# EAGLE design Drone (EAGLE 9.6.2)
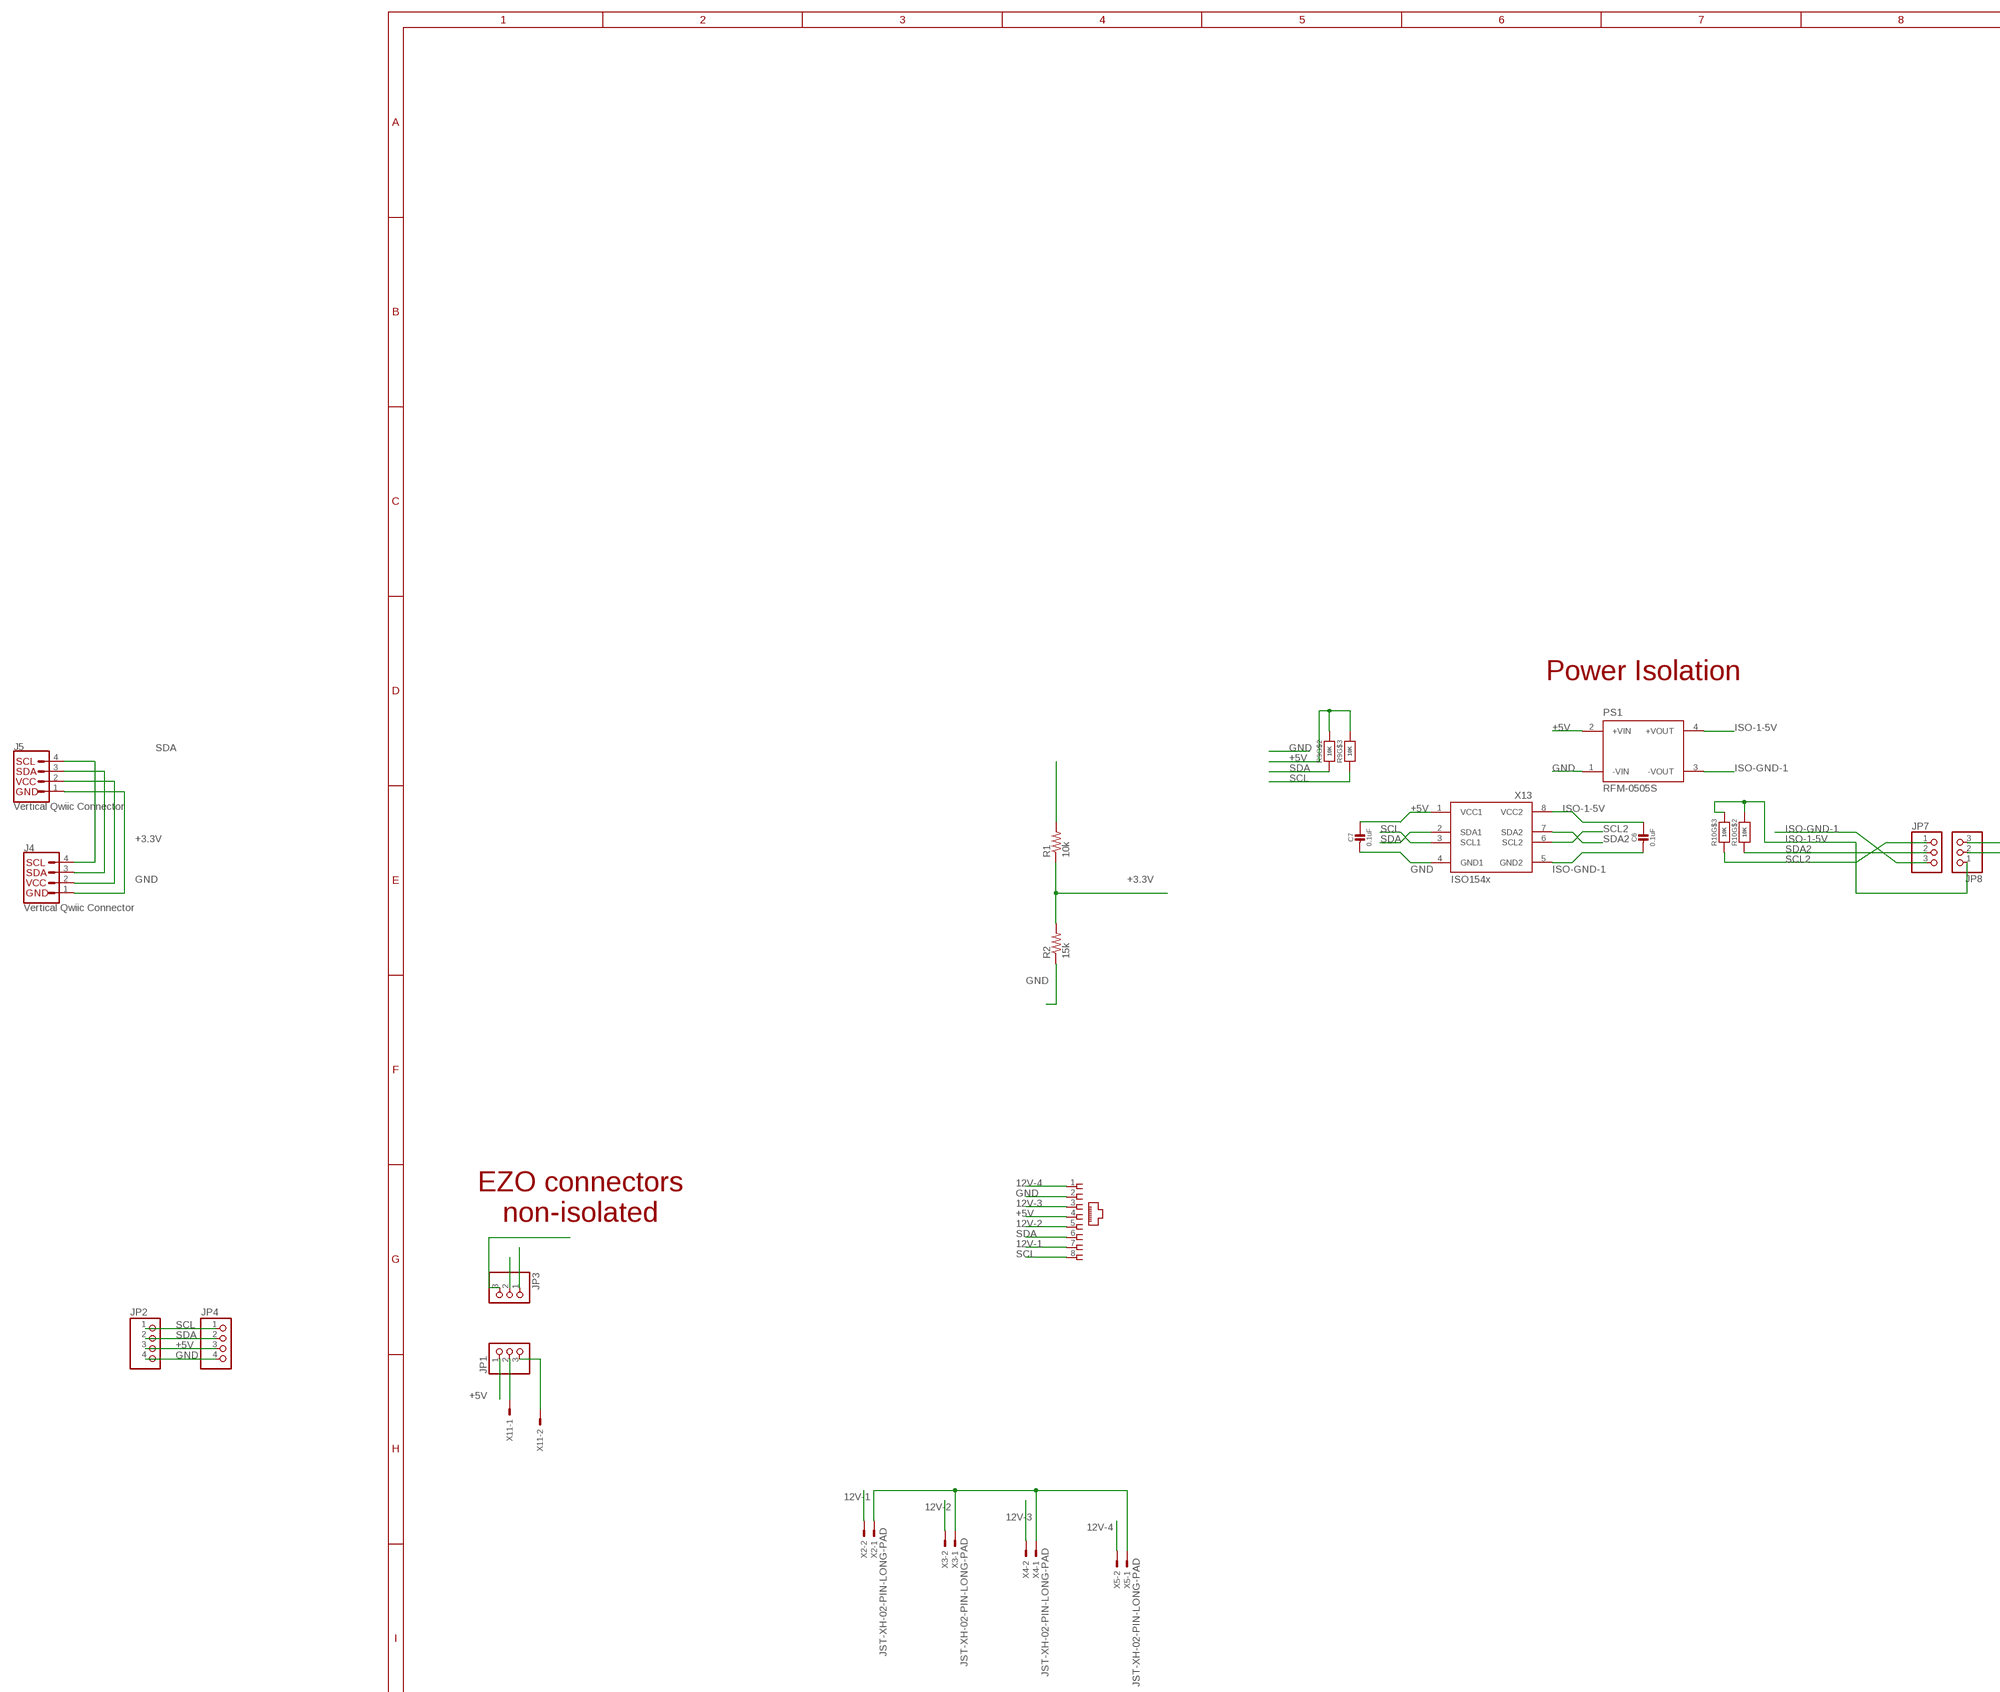
[diagram p0: schematic, sheet 1, part 1 of 2]
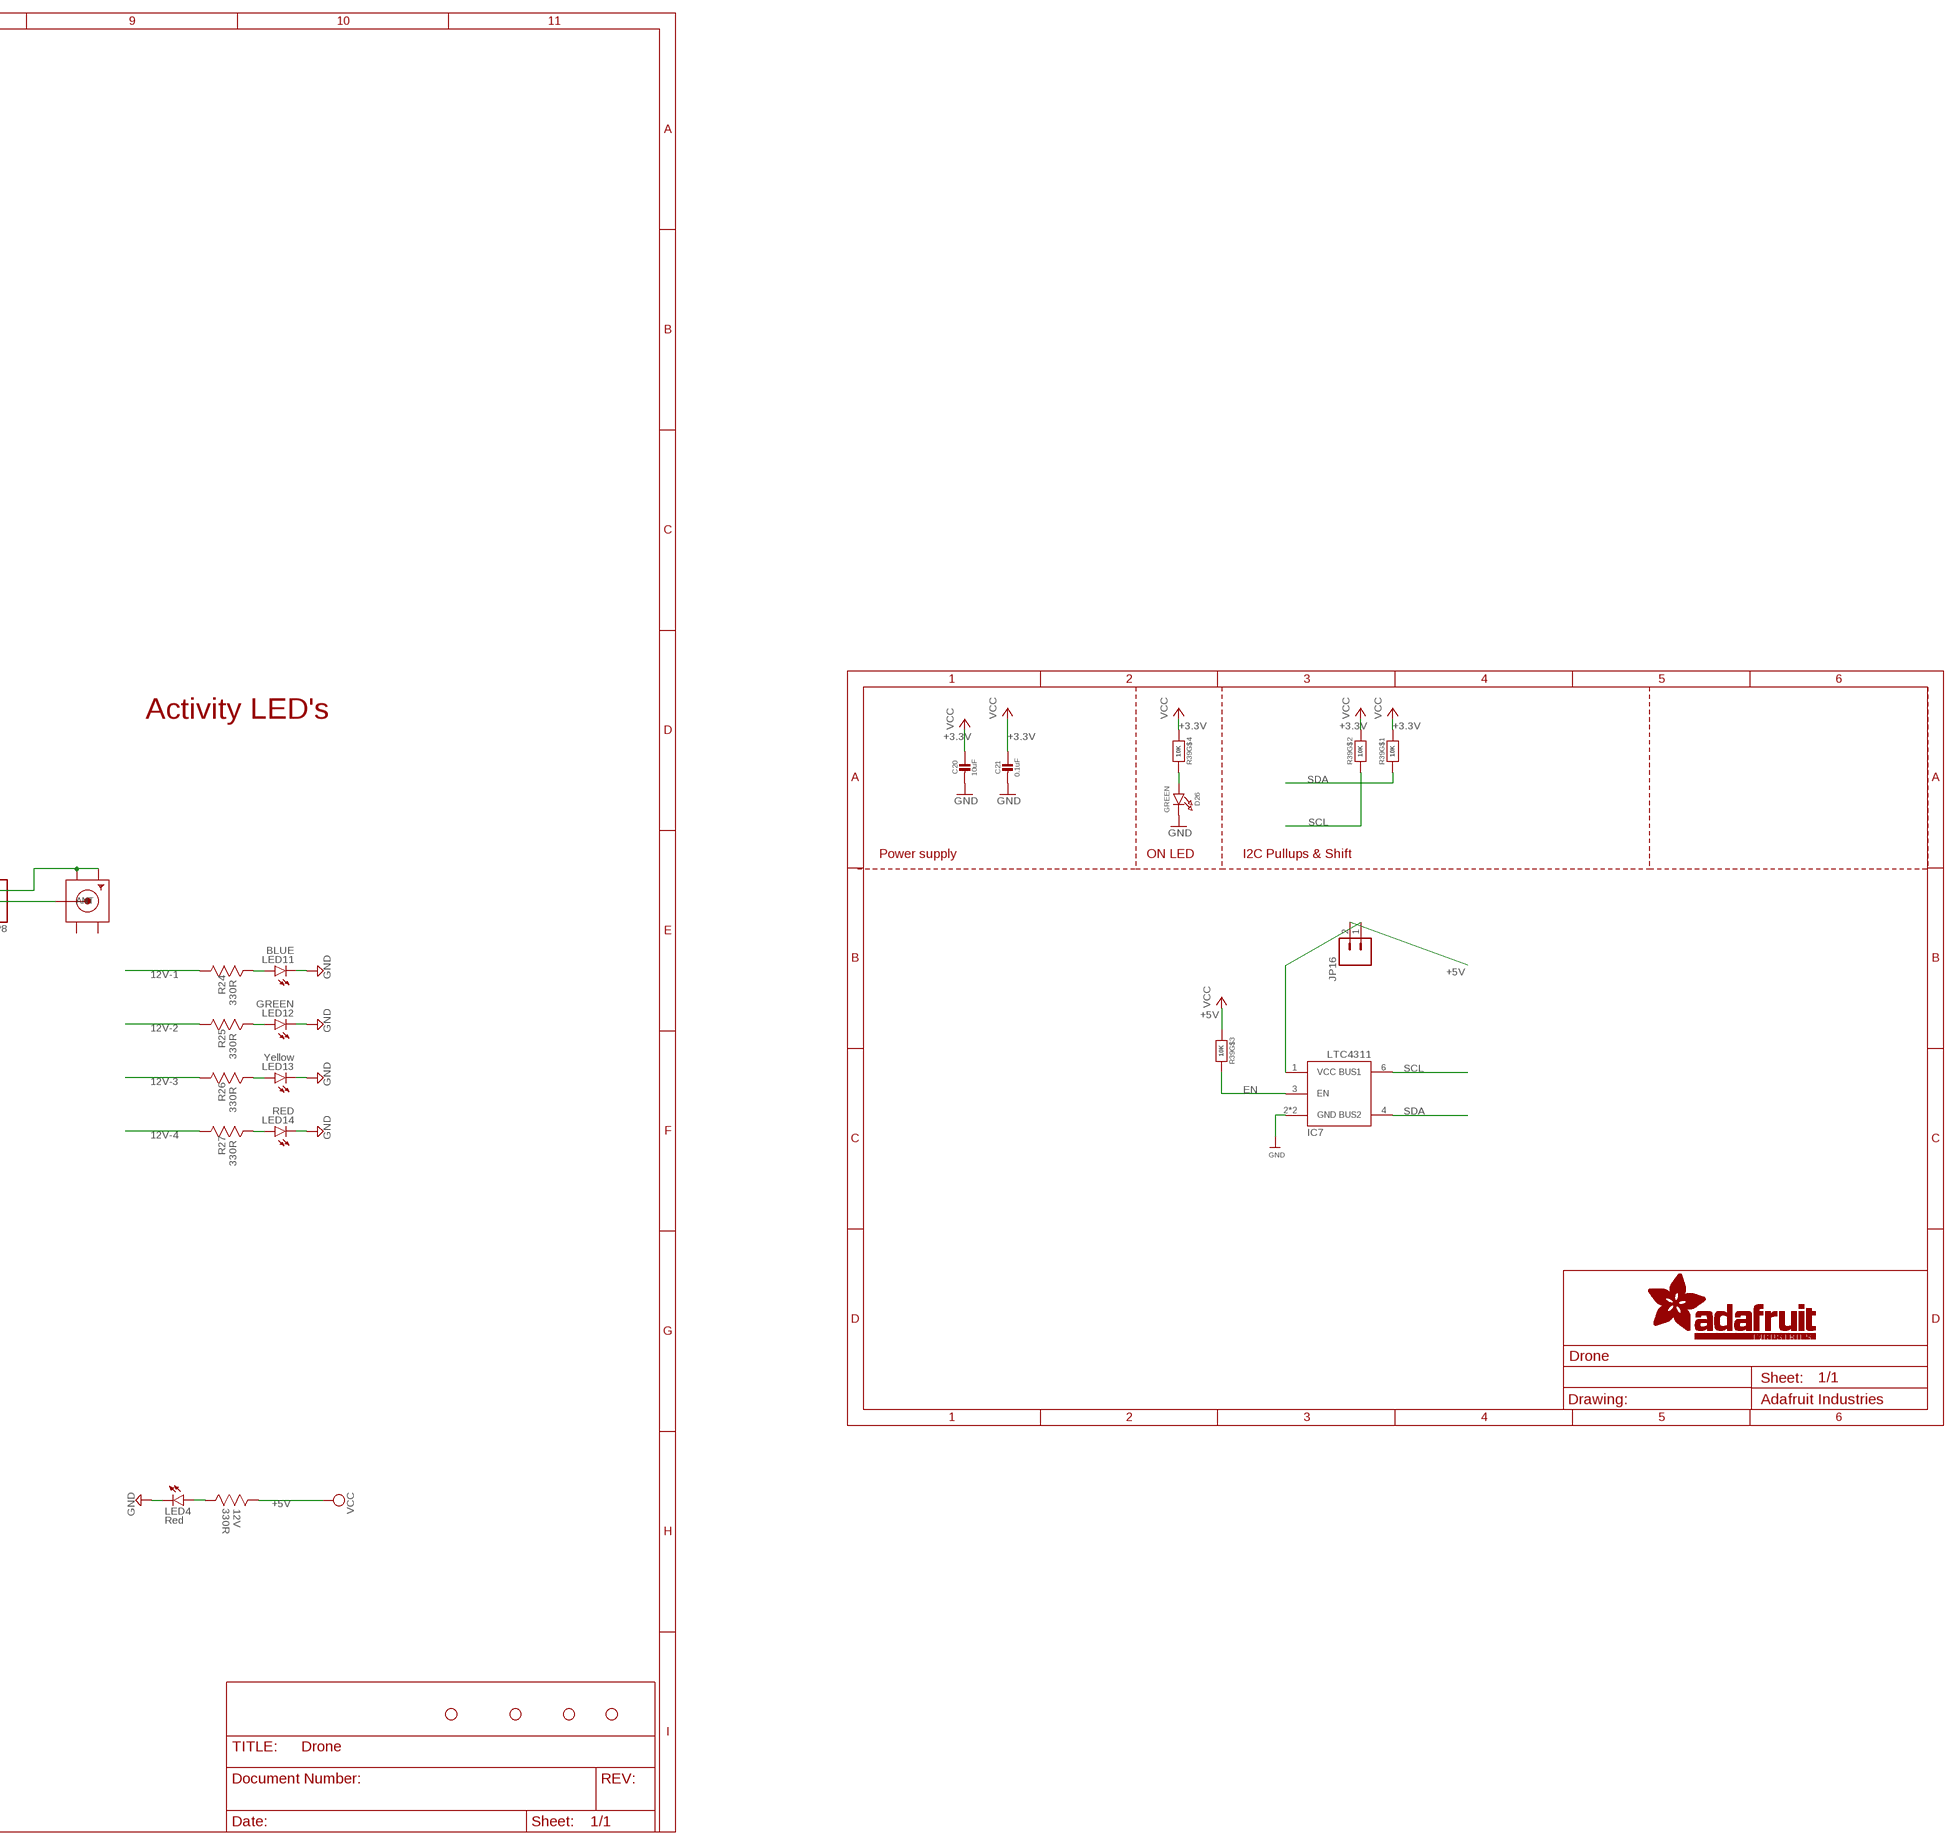
[diagram p1: schematic, sheet 1, part 2 of 2]

## Parts
12V  330R  MC0.063W06031%330R  [RESC1608X60N]
C6  0.1uF  CAP_CERAMIC0603_NO  [0603-NO]
C7  0.1uF  CAP_CERAMIC0603_NO  [0603-NO]
C20  10uF  CAP_CERAMIC0805-NOOUTLINE  [0805-NO]
C21  0.1uF  CAP_CERAMIC0603_NO  [0603-NO]
D26  GREEN  LED0603_NOOUTLINE  [CHIPLED_0603_NOOUTLINE]
H5  STAND-OFF  [STAND-OFF]
H6  STAND-OFF  [STAND-OFF]
H7  STAND-OFF  [STAND-OFF]
H8  STAND-OFF  [STAND-OFF]
IC7  LTC4311_SC70  [SC70-6L]
J4  Vertical Qwiic Connector  QWIIC_CONNECTOR  [JST04_1MM_VERT]
J5  Vertical Qwiic Connector  QWIIC_CONNECTOR  [JST04_1MM_VERT]
JP1  PINHD-1X3CB  [1X03-CLEANBIG]
JP2  PINHD-1X4  [1X04]
JP3  PINHD-1X3CB  [1X03-CLEANBIG]
JP4  PINHD-1X4  [1X04]
JP7  PINHD-1X3CB  [1X03-CLEANBIG]
JP8  PINHD-1X3CB  [1X03-CLEANBIG]
JP16  CONN_02  [1X02]
LED4  Red  LED-RED-0603-WE  [LED-0603]
LED11  BLUE  LED-BLUE0603  [LED-0603]
LED12  GREEN  LED-GREEN0603  [LED-0603]
LED13  Yellow  LED-YELLOW0603  [LED-0603]
LED14  RED  LED-RED0603  [LED-0603]
PS1  RFM-0505S  [CONV_RFM-0505S]
PUMPBOX-2  RJ45-6L-B  [RJ45-NO-SHIELD]
R1  10k  R-US_R0805  [R0805]
R2  15k  R-US_R0805  [R0805]
R9  10K  RESISTOR_4PACK  [RESPACK_4X0603]
R10  10K  RESISTOR_4PACK  [RESPACK_4X0603]
R24  330R  MC0.063W06031%330R  [RESC1608X60N]
R25  330R  MC0.063W06031%330R  [RESC1608X60N]
R26  330R  MC0.063W06031%330R  [RESC1608X60N]
R27  330R  MC0.063W06031%330R  [RESC1608X60N]
R39  10K  RESISTOR_4PACK  [RESPACK_4X0603]
X1  SMACONNECTOR_EDGE  [SMA_EDGELAUNCH]
X2  JST-XH-02-PIN-LONG-PAD  [JST-XH-02-PACKAGE-LONG-PAD]
X3  JST-XH-02-PIN-LONG-PAD  [JST-XH-02-PACKAGE-LONG-PAD]
X4  JST-XH-02-PIN-LONG-PAD  [JST-XH-02-PACKAGE-LONG-PAD]
X5  JST-XH-02-PIN-LONG-PAD  [JST-XH-02-PACKAGE-LONG-PAD]
X11  jst-xh-2  JST-XH-02-PIN-LONG-PAD  [JST-XH-02-PACKAGE-LONG-PAD]
X13  ISO154X  [SOIC8_150MIL]

## Nets
12V-1: PUMPBOX-2.7 R24.1(R1) X2.2
12V-2: PUMPBOX-2.5 R25.1(R1) X3.2
12V-3: PUMPBOX-2.3 R26.1(R1) X4.2
12V-4: PUMPBOX-2.1 R27.1(R1) X5.2
+3.3V [3.3v]: C20.1 C21.1 J4.2 J5.2 R1.1 R2.2 R39.4 R39.7 R39.8 ; supply symbol labelled VCC
+5V [5v]: 12V.1(R1) C7.1 JP1.1 JP2.3 JP4.3 JP16.2 PS1.2(+VIN) PUMPBOX-2.4 R1.2 R9.6 R9.7 R39.3 X13.1(VCC1) ; supply symbol labelled VCC
EN: IC7.3(EN) R39.6
GND: C7.2 C20.2 C21.2 D26.C IC7.2(GND) IC7.5(GND) J4.1 J5.1 JP2.4 JP3.3 JP4.4 LED4.C LED11.C LED12.C LED13.C LED14.C PS1.1(-VIN) PUMPBOX-2.2 R2.1 X2.1 X3.1 X4.1 X5.1 X13.4(GND1)
ISO-1-5V: C6.1 JP8.1 PS1.4(+VOUT) R10.6 R10.7 X13.8(VCC2)
ISO-GND-1: C6.2 JP7.3 PS1.3(-VOUT) X13.5(GND2)
N$1: JP1.2 X11.1
N$2: JP3.2
N$3: JP1.3 X11.2
N$14: JP8.3 X1.GND@3(GND2) X1.GND@4(GND1)
N$16: JP8.2 X1.P(ANT)
N$39: IC7.1(VCC) JP16.1
N$41: D26.A R39.5
N$47: 12V.2(R2) LED4.A
N$54 [GPIO]: LED11.A R24.2(R2)
N$55 [GPIO]: LED12.A R25.2(R2)
N$56 [GPIO]: LED13.A R26.2(R2)
N$57 [GPIO]: LED14.A R27.2(R2)
SCL: IC7.6(BUS1) J4.4 J5.4 JP2.1 JP3.1 JP4.1 PUMPBOX-2.8 R9.3 R39.2 X13.3(SCL1)
SCL2: JP7.1 R10.3 X13.6(SCL2)
SDA: IC7.4(BUS2) J4.3 J5.3 JP2.2 JP4.2 PUMPBOX-2.6 R9.2 R39.1 X13.2(SDA1)
SDA2: JP7.2 R10.2 X13.7(SDA2)
Unconnected: R9.1 R9.4 R9.5 R9.8 R10.1 R10.4 R10.5 R10.8

## Notes on the sheet
- Power Isolation | Activity LED's
- Power supply | ON LED | I2C Pullups & Shift
- EZO connectors
  non-isolated

## Power pins joined to a net without a drawn wire
GND3: X1.GND@2(GND3)
GND4: X1.GND@1(GND4)

## Library data of the parts
12V R24-R27 = Multicomp:MC0.063W06031%330R: RESISTOR, 0603; MPN: MC0.063W06031%330R; OC_FARNELL: 9331018; OC_NEWARK: -; SUPPLIER: Multicomp; TOLERANCE: ±1%; VALUE: 330 Ohms; WATTAGE: 1/16 W
C6 C7 C20 C21 = microbuilder:CAP_CERAMIC: Ceramic Capacitors For new designs, use the packages preceded by an '_' character since they are more reliable: The following footprints should be used on most boards: _0402 - Standard footprint for regular board layouts _0603 - Standard footprint for regular board layouts _0805 - Standard footprint for regular board layouts _1206 - Standard footprint for regular board layouts For extremely tight-pitch boards where space is at a premium, the following 'micro-pitch' footprints can be used (smaller pads, no silkscreen outline, etc.): _0402MP - Micro-pitch footprint for very dense/compact boards _0603MP - Micro-pitch footprint for very dense/compact boards _0805MP - Micro-pitch footprint for very dense/compact boards _1206MP - Micro-pitch footprint for very dense/compact boards
D26 = microbuilder:LED: LED 0603 - 0603 Surface Mount Package 2mA: Green LED - Low Power (3.9mcd, 2ma, 1.7Vf) - Digikey: 475-2709-2-ND Orange LED - Low Power (9.8mcd, 2ma, 1.8Vf) - Digikey: 475-1194-2-ND Red LED - Low Power (5mcd, 2ma, 1.8Vf) - Digikey: 475-1195-2-ND Yellow LED - Low Power (7mcd, 2ma, 1.8Vf) - Digikey: 475-1196-2-ND 5mA: Blue LED - Low Power (17mcd, 5ma, 2.9Vf) - Digikey: LNJ937W8CRACT-ND 0805 - 0805 Surface Mount Package 2mA: Red LED (8.8mcd, 2mA, 1.8Vf, Clear) - Low Power [Digikey: 475-2510-1-ND] Green LED (5mcd, 2mA, 1.8Vf, Clear) - Low Power [Digikey: 475-2730-1-ND] Yellow LED (11.3mcd, 2mA, 1.8Vf, Clear) - Low Power [Digikey: 475-2555-1-ND] 20mA: Red LED (104mcd, 20mA, Diffused) - LS R976 [Digikey: 475-1278-6-ND] Red LED (12mcd, 20mA, 2.0Vf, Clear) - APT2012EC [Digikey: 754-1128-1-ND] Green LED (15mcd, 20mA, 2.2Vf, Clear) - APT2012GC [Digikey: 754-1131-1-ND] Orange LED (160mcd, 20mA, 2.1Vf, Clear) - APT2012SECK [Digikey: 754-1130-1-ND] 1206 - 1206 Surface Mount Package Green LED (26mcd, 20mA, Diffused) - LG N971 [Digikey: 475-1407-6-ND] Red LED (15mcd, 20mA, Diffused) - LH N974 [Digikey: 475-1416-6-ND] Cree - Cree High-Power Surface Mount LEDs XPEBWT-L1-0000-00D50 - White 111lm 350mA 2.9Vf 6200K 110° XTEAWT-00-0000-00000LEE3 - White 114lm 350mA 2.85Vf 5000K 115° Everlight - Everlight 45-21 Series Surface Mount LEDs 45-21/QK2C-B2832AC2CB2/2T - Warm White 2000mcd 20mA 3.25Vf 3050K 120° 45-21/LK2C-B38452C4CB2/2T - Nuetral White 2000mcd 20mA 3.25Vf 4150K 120° 45-21/LK2C-B50634C6CB2/2T - Cold White 2200mcd 20mA 3.25Vf 5650K 120° PLCC2 Reverse Mount LS T77K-J1L2-1-0-2-R18-Z - Red 11.25mcd 2mA 1.8Vf 630nm 120° LO T77K-L1M2-24-Z - Orange 19.6mcd 2mA 1.8Vf 606nm 120° LY T77K-K2M1-26-Z - Yellow 15.7mcd 2mA 1.8Vf 587nm 120°
H5-H8 = SparkFun-Hardware:STAND-OFF: Stand Off Drill holes for mechanically mounting via screws, standoffs, etc. Note: Use the keepout ring to avoid running the screw head into surrounding components. Variant Overviews STAND-OFF - Mechanical footprint for a #4 phillips button head screw. STAND-OFF-TIGHT - Mechanical footprint for a #4 phillips button head screw, Example SparkFun Products Screw - Phillips Head (1/4", 4-40, 10 pack) <https://www.sparkfun.com/products/10453> (PRT-10453) Screw - Phillips Head (1/2", 4-40, 10 pack) <https://www.sparkfun.com/products/10452> (PRT-10452) Screw - Phillips Head (3/4", 4-40, 10 pack) <https://www.sparkfun.com/products/10451> (PRT-10451) Screw - Phillips Head (1", 4-40, 10 pack) <https://www.sparkfun.com/products/10450> (PRT-10450)
IC7 = microbuilder:LTC4311
J4 J5 = SparkFun-Connectors:QWIIC_CONNECTOR: SparkFun I2C Standard Qwiic Connector An SMD 1mm pitch JST connector makes it easy and quick (get it? Qwiic?) to connect I2C devices to each other. The Qwiic system <http://www.sparkfun.com/qwiic> enables fast and solderless connection between popular platforms and various sensors and actuators. We carry 200mm <https://www.sparkfun.com/products/14204>, 100mm <https://www.sparkfun.com/products/14205>, 50mm <https://www.sparkfun.com/products/14206>, and breadboard friendly <https://www.sparkfun.com/products/14207> Qwiic cables. We also offer 10 pcs strips <https://www.sparkfun.com/products/14323> the SMD connectors.; PROD_ID: CONN-14483
JP1 JP3 JP7 JP8 = adafruit:PINHD-1X3: PIN HEADER
JP2 JP4 = pinhead:PINHD-1X4: PIN HEADER
JP16 = SparkFun-Connectors:CONN_02: Multi connection point. Often used as Generic Header-pin footprint for 0.1 inch spaced/style header connections On any of the 0.1 inch spaced packages, you can populate with these: Break Away Headers - Straight <https://www.sparkfun.com/products/116> (PRT-00116) Break Away Male Headers - Right Angle <https://www.sparkfun.com/products/553> (PRT-00553) Female Headers <https://www.sparkfun.com/products/115> (PRT-00115) Break Away Headers - Machine Pin <https://www.sparkfun.com/products/117> (PRT-00117) Break Away Female Headers - Swiss Machine Pin <https://www.sparkfun.com/products/743> (PRT-00743) For SCREWTERMINALS and SPRING TERMINALS visit here: Screw Terimnals on SparkFun.com <https://www.sparkfun.com/search/results?term=Screw+Terminals> (5mm/3.5mm/2.54mm spacing) This device is also useful as a general connection point to wire up your design to another part of your project. Our various solder wires solder well into these plated through hole pads. Hook-Up Wire - Assortment (Stranded, 22 AWG) <https://www.sparkfun.com/products/11375> (PRT-11375) Hook-Up Wire - Assortment (Solid Core, 22 AWG) <https://www.sparkfun.com/products/11367> (PRT-11367) View the entire wire category on our website here <https://www.sparkfun.com/categories/141> Special notes: Molex polarized connector foot print use with: PRT-08233 with associated crimp pins and housings. 2.54_SCREWTERM for use with PRT-10571. 3.5mm Screw Terminal footprints for PRT-08084 5mm Screw Terminal footprints for use with PRT-08432
LED4 = SparkFun-LED:LED-RED: Red SMD LED Used in manufacturing of most products at SparkFun Packages: 0603 - SMD 0603 package [Product Link] <http://docs.avagotech.com/docs/AV02-0551EN> 0603 SMART - SMD 0603 SMART package ( more efficient and expensive)[Product Link] <http://www.osram-os.com/Graphics/XPic2/00077099_0.pdf> 1206 - SMD1206 package [Product Link] <https://www.sparkfun.com/datasheets/DevTools/LilyPad/Q150OVS4.pdff> SparkFun Products: Pro Mini 328 -5V <https://www.sparkfun.com/products/821> RedBoard <https://www.sparkfun.com/products/12757> IOIO-OTG <https://www.sparkfun.com/products/13613>; PROD_ID: DIO-16511
LED11 = SparkFun-LED:LED-BLUE: Blue SMD LED Used in manufacturing of various products at SparkFun Packages: 0603 - SMD 0603 package [Product Link] <http://www.digikey.com/product-detail/en/SMLE12BC7TT86/511-1589-2-ND/1641808> 1206 - SMD1206 package [Product Link] <http://www.digikey.com/product-detail/en/lite-on-inc/LTST-C150TBKT/160-1643-1-ND/573584> SparkFun Products: ESP8266 Thing-Dev Board <https://www.sparkfun.com/products/13711> RedBoard <https://www.sparkfun.com/products/12757>; PROD_ID: DIO-08575
LED12 = SparkFun-LED:LED-GREEN: Green SMD LED Used in manufacturing of various products at SparkFun Packages: 0603 - SMD 0603 package [Product Link] <http://www.futureelectronics.com/en/technologies/semiconductors/optoelectronics/leds/Pages/9894312-LTST-C190GKT.aspx?CrossPart=HSMG-C190&IM=0> LilyPad 1206 - SMD1206 LilyPad package [Product Link] <http://www.futureelectronics.com/en/Technologies/Product.aspx?ProductID=IN150NGHARVATEKCORPORATION2049943&IM=0> 1206 - SMD1206 package [Product Link] <http://www.futureelectronics.com/en/technologies/semiconductors/optoelectronics/leds/Pages/8315665-LTST-C150KGKT.aspx?IM=0> 1206 Bottom Mount -SMD 1206 Bottom Mount [Product Link] <http://www.digikey.com/product-detail/en/lite-on-inc/LTST-C230KGKT/160-1456-1-ND/386854> SparkFun Products: Pro Mini 328 -5V <https://www.sparkfun.com/products/821> RedBoard <https://www.sparkfun.com/products/12757> MP3 Trigger <https://www.sparkfun.com/products/13720> Makey Makey <https://www.sparkfun.com/products/11076>; PROD_ID: DIO-00821
LED13 = SparkFun-LED:LED-YELLOW: Yellow SMD LED Used in manufacturing several products at SparkFun. Packages: 0603 - SMD 0603 package[Product Link] <http://www.kingbrightusa.com/product.asp?catalog_name=LED&product_id=APT1608SYCK> 0603 -SMART - SMART SMD 0603 package (more efficient/more expensive) [Product Link] <http://www.osram-os.com/osram_os/en/products/product-catalog/led-light-emitting-diodes/smartled-0603/ly-l29k/index.jsp> LilyPad - SMD1206 package[Product Datasheet] <https://www.sparkfun.com/datasheets/DevTools/LilyPad/Q150YUS4.pdf> SparkFun Products: Blynk Board <https://www.sparkfun.com/products/13794> IOIO-OTG <https://www.sparkfun.com/products/13613> XBee Explorer Serial <https://www.sparkfun.com/products/13225>; PROD_ID: DIO-09003
LED14 = SparkFun-LED:LED-RED: Red SMD LED Used in manufacturing of most products at SparkFun Packages: 0603 - SMD 0603 package [Product Link] <http://docs.avagotech.com/docs/AV02-0551EN> 0603 SMART - SMD 0603 SMART package ( more efficient and expensive)[Product Link] <http://www.osram-os.com/Graphics/XPic2/00077099_0.pdf> 1206 - SMD1206 package [Product Link] <https://www.sparkfun.com/datasheets/DevTools/LilyPad/Q150OVS4.pdff> SparkFun Products: Pro Mini 328 -5V <https://www.sparkfun.com/products/821> RedBoard <https://www.sparkfun.com/products/12757> IOIO-OTG <https://www.sparkfun.com/products/13613>; PROD_ID: DIO-00819
PS1 = RFM-0505S:RFM-0505S: DC/DC Converter, 1 Watt, SIP4, Single Output Check availability <https://pricing.snapeda.com/parts/RFM-0505S/Recom%20Power/view-part?ref=eda>; AVAILABILITY: In Stock; DESCRIPTION: 1W DC/DC-Converter 'ECONOLINE' SIP4 1kV unreg; MF: Recom Power; MP: RFM-0505S; PACKAGE: SIP-4 Recom Power; PRICE: None; PURCHASE-URL: https://pricing.snapeda.com/search/part/RFM-0505S/?ref=eda
PUMPBOX-2 = con-tycoelectronics:RJ45: CORCOM Modular RJ Jacks No Shield Source: www.tycoelectronics.com .. ENG_DS_1654001_1099_RJ_L_0507.pdf; MPN: RJ45-6L-B; OC_FARNELL: unknown; OC_NEWARK: 16R6090
R1 R2 = rcl:R-US_: RESISTOR, American symbol; SPICEPREFIX: R
R9 R10 R39 = microbuilder:RESISTOR_4PACK: Resistor Packs (4 resistors) 4 x 0603 10K 1/16W - Digikey: YC164J-10KCT-ND
X1 = adafruit@1:SMACONNECTOR: SMA Connector 90° DIP SMA Connector, 50 Ohm (4UConnector: 07259)
X2-X5 X11 = Rembrandt Electronics - JST XH Connectors v1-0:JST-XH-02-PIN: JST XH Connector 2 Pin Wire to board connector. Pitch: 2,54 mm, (0.100") Number of pins: 2 Created by Rembrandt Electronics www.rembrandtelectronics.com
X13 = adafruit_power:ISO154X

## Net classes
0 default: width 0.356 mm, drill 0.102 mm, clearance 0.254 mm
1 highpower: width 0.356 mm, drill 0.356 mm
2 12v: width 0.457 mm, drill 0.102 mm, clearance 0.254 mm
3 5v: width 0.406 mm, drill 0.102 mm, clearance 0.254 mm
4 3.3v: width 0.406 mm, drill 0.102 mm, clearance 0.254 mm
5 i2c: width 0.356 mm, drill 0.102 mm, clearance 0.254 mm
6 GPIO: width 0.356 mm, drill 0.102 mm, clearance 0.254 mm
8 New Class: drill 0.102 mm, clearance 0.152 mm

## Board
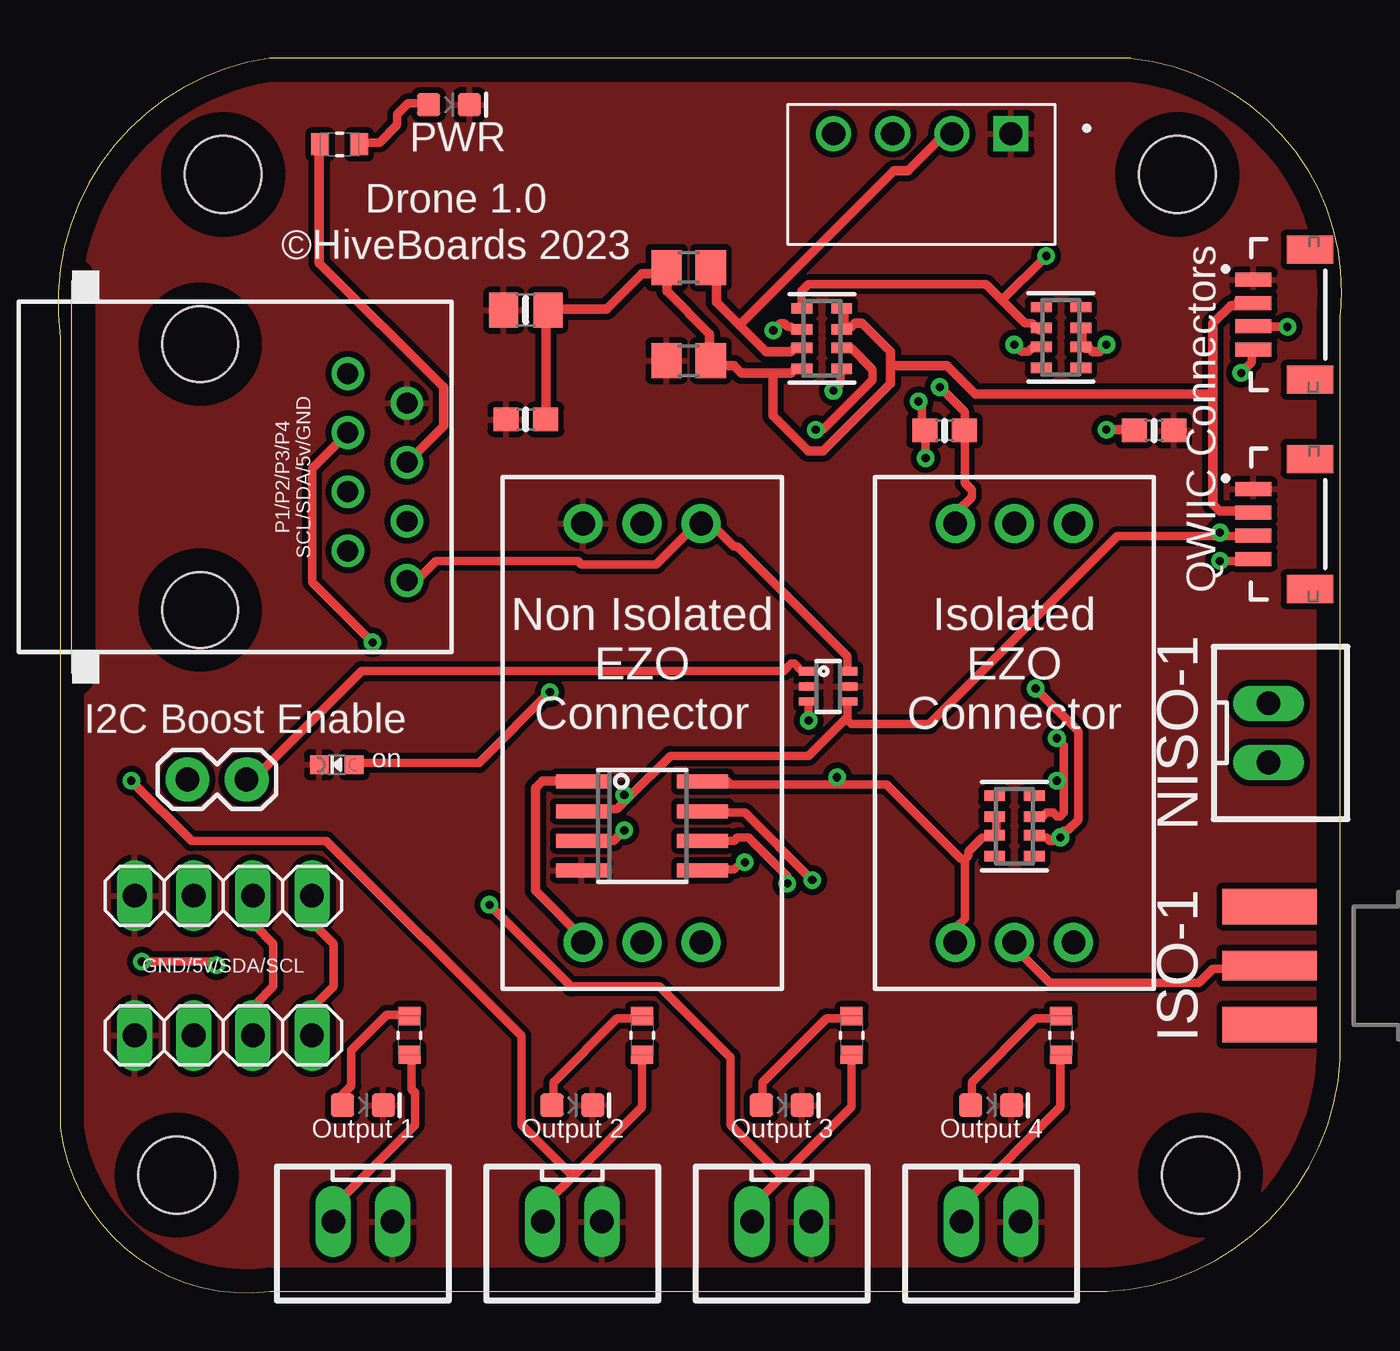
[diagram p2: board, top side]
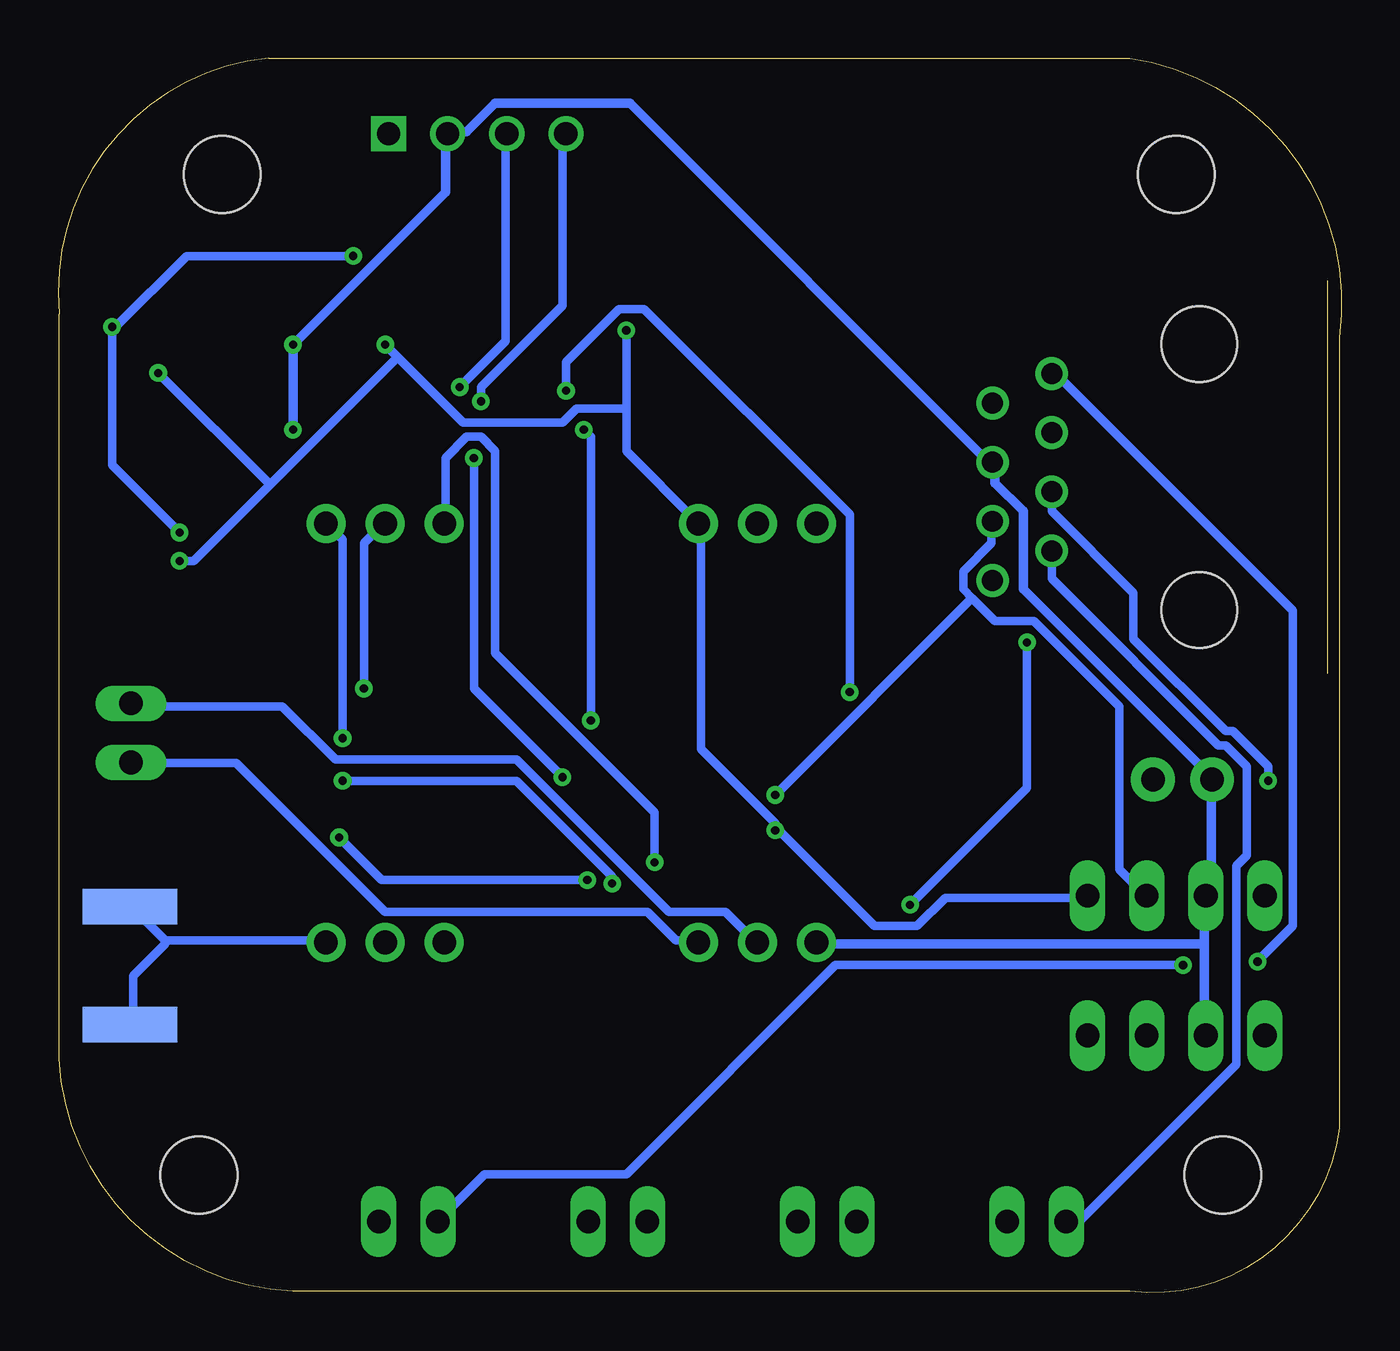
[diagram p3: board, bottom side, seen from below]

Size 55.15 x 53.06 mm. Coordinates in mm from the lower left corner, seen from the top.
Outline: 9.1,0.06 44.1,0.06 arc90 55.1,10.06 55.1,42.06 arc90 46.1,53.06 9.1,53.06 arc90 0.1,41.06 0.1,7.06 arc90 9.1,0.06
Copper layers (1*16): Top 0.035mm / dielectric 1.5mm / Bottom 0.035mm
Design rules "default *": minimum track width 6mil, minimum drill 0.35mm, track to track 6mil, track to pad 6mil, pad to pad 6mil, via to via 6mil, smd to smd 6mil, copper to edge 40mil, drill to drill 6mil, minimum pad ring 10mil, minimum via ring 8mil, stop-mask expansion 4mil, vias tented up to drill 0mil, thermal gap 10mil

### Footprints (pad centres in the part's own frame; a part is rotated, then mirrored left to right if it is on the bottom)
RESC1608X60N = smd 0.762 x 0.94: 1 -0.838,0; 2 0.838,0
0603-NO = smd 1.075 x 1: 1 -0.85,0; 2 0.85,0
0805-NO = smd 1.24 x 1.5: 1 -0.95,0; 2 0.95,0
CHIPLED_0603_NOOUTLINE = smd 0.8 x 0.8: A 0,-0.75; C 0,0.75
STAND-OFF = hole 3.302: 0,0
SC70-6L = smd 0.35 x 0.8: 1 -0.65,-0.85; 2 0,-0.85; 3 0.65,-0.85; 4 0.65,0.85; 5 0,0.85; 6 -0.65,0.85
JST04_1MM_VERT = smd 0.6 x 1.55: 1 -1.478,0.775; 2 -0.478,0.775; 3 0.522,0.775; 4 1.522,0.775 | smd 1.2 x 2: NC1 -2.778,3.2; NC2 2.822,3.2
1X03-CLEANBIG = drill 1.016 pad 1.676: 1 -2.54,0; 2 0,0; 3 2.54,0
1X04 = drill 1.016 long: 1 -3.81,0; 2 -1.27,0; 3 1.27,0; 4 3.81,0
1X02 = drill 1.016 pad 1.88: 1 0,0; 2 2.54,0
LED-0603 = smd 1 x 1: A -0.877,0; C 0.877,0
CONV_RFM-0505S = drill 1 square: 1 -3.85,-1.75 | drill 1: 2 -1.31,-1.75; 3 1.23,-1.75; 4 3.77,-1.75
RJ45-NO-SHIELD = drill 0.9 pad 1.4: 1 -4.445,6.35; 2 -3.175,8.89; 3 -1.905,6.35; 4 -0.635,8.89; 5 0.635,6.35; 6 1.905,8.89; 7 3.175,6.35; 8 4.445,8.89 | hole 3.251: -5.715,0; 5.715,0
R0805 = smd 1.3 x 1.5: 1 -0.95,0; 2 0.95,0
RESPACK_4X0603 = smd 0.45 x 0.9: 1 -1.3,-0.85; 2 -0.4,-0.85; 3 0.4,-0.85; 4 1.3,-0.85; 5 1.3,0.85; 6 0.4,0.85; 7 -0.4,0.85; 8 -1.3,0.85
SMA_EDGELAUNCH = smd 4.064 x 1.524: GND@1 2.032,-2.54; GND@2 2.032,2.54 | smd 4.064 x 1.524 bottom: GND@3 2.032,2.54; GND@4 2.032,-2.54 | smd 4.064 x 1.27: P 2.032,0
JST-XH-02-PACKAGE-LONG-PAD = drill 1.016 long: 1 -1.27,0; 2 1.27,0
SOIC8_150MIL = smd 0.6 x 2.2: 1 -1.905,-2.6; 2 -0.635,-2.6; 3 0.635,-2.6; 4 1.905,-2.6; 5 1.905,2.6; 6 0.635,2.6; 7 -0.635,2.6; 8 -1.905,2.6

### Placement (x,y rotation side)
12V  12.1,49.36 0 top
C6  38.1,37.06 0 top
C7  47.1,37.06 0 top
C20  20.1,42.23 180 top
C21  20.1,37.54 180 top
D26  11.97,22.69 90 top
H5  7.1,48.06 0 top
H6  5.1,5.06 0 top
H7  49.1,5.06 0 top
H8  48.1,48.06 0 top
IC7  33.1,26.06 270 top
J4  50.6,42.06 270 top
J5  50.6,33.06 270 top
JP1  25.1,15.06 0 top
JP2  7.1,17.06 180 top
JP3  25.1,33.06 180 top
JP4  7.1,11.06 180 top
JP7  41.1,33.06 180 top
JP8  41.1,15.06 0 top
JP16  8.1,22.06 180 top
LED4  16.8,51.06 0 top
LED11  13.1,8.06 0 top
LED12  22.1,8.06 0 top
LED13  31.1,8.06 0 top
LED14  40.1,8.06 0 top
PS1  37.1,48.06 180 top
PUMPBOX-2  6.1,35.06 270 top
R1  27.1,44.06 0 top
R2  27.1,40.06 0 top
R9  43.1,41.06 270 top
R10  41.1,20.06 90 top
R24  15.1,11.06 90 top
R25  25.1,11.06 90 top
R26  34.1,11.06 90 top
R27  43.1,11.06 90 top
R39  32.82,41.01 270 top
X1  54.1,14.06 180 top
X2  13.1,3.06 180 top
X3  22.1,3.06 180 top
X4  31.1,3.06 180 top
X5  40.1,3.06 180 top
X11  52.02,24.06 270 top
X13  25.1,20.06 270 top

### Tracks (layer width: path | path; a pad name or v marks a point on that pad's centre or on a via)
12V-1
  Top 0.356: R24.1 15.18,10.12 15.18,8.75 15.34,8.59 15.34,7.22 11.83,3.72 11.83,3.11 X2.2
  Bottom 0.356: PUMPBOX-2.7 12.44,31.76 12.44,30.69 5.28,23.53 4.97,23.53 4.06,22.61 4.06,18.8 4.52,18.35 4.52,9.81 11.22,3.11 11.68,3.11 X2.2
12V-2  (via drill 0.35)
  Top 0.356: 22.12,5.01 20.98,3.87 20.98,3.11 X3.2 | 22.12,5.01 25.09,7.98 25.09,10.12 R25.1 | v3.14,22 5.74,19.41 11.53,19.41 19.91,11.03 19.91,7.22 22.12,5.01
  Bottom 0.356: v3.14,22 3.14,22.61 4.67,24.14 4.97,24.14 8.94,28.1 8.94,30.08 12.44,33.59 12.44,34.35 PUMPBOX-2.5
12V-3  (via drill 0.35)
  Top 0.356: 31.11,5.01 29.97,3.87 29.97,3.11 X4.2 | 31.11,5.01 34.08,7.98 34.08,10.12 R26.1 | v13.51,27.95 10.92,30.54 10.92,35.42 12.44,36.94 PUMPBOX-2.3 | v18.54,16.67 22.04,13.16 25.85,13.16 28.9,10.12 28.9,7.22 31.11,5.01
  Bottom 0.356: v13.51,27.95 13.51,21.7 v18.54,16.67
12V-4  (via drill 0.35)
  Top 0.356: R27.1 43.07,10.12 43.07,7.98 38.96,3.87 38.96,3.11 X5.2 | v3.6,14.23 6.65,14.23 v6.8,14.08
  Bottom 0.356: v3.6,14.23 2.08,15.76 2.08,29.32 12.14,39.38 12.44,39.38 PUMPBOX-2.1 | v6.8,14.08 21.74,14.08 30.73,5.09 36.82,5.09 38.81,3.11 X5.2
+3.3V
  Top 0.406: 49.63,38.62 49.63,41.66 50.39,42.43 50.54,42.43 50.69,42.58 51.3,42.58 J4.2 | 49.63,38.62 49.63,33.89 49.93,33.59 51.3,33.59 J5.2 | C21.1 20.98,37.55 20.98,42.12 C20.1 21.13,42.27 23.57,42.27 25.09,43.8 26,43.8 R1.1 26.16,43.95 26.16,43.04 27.99,41.21 27.99,40.14 R2.2 28.14,39.99 28.29,39.83 29.05,39.83 29.36,39.53 30.73,39.53 | R39.8 33.78,42.27 33.78,41.51 R39.7 33.93,41.51 34.08,41.51 34.23,41.66 34.54,41.66 35.76,40.44 35.76,39.83 | 30.73,39.53 31.49,39.53 31.64,39.68 31.95,39.68 R39.4 | 35.76,39.83 35.76,39.07 32.86,36.18 32.25,36.18 30.73,37.7 30.73,39.53 | 49.63,38.62 39.42,38.62 38.2,39.83 35.76,39.83
+5V  (via drill 0.35)
  Top 0.406: 29.28,41.59 28.29,42.58 28.29,43.8 28.14,43.95 R1.2 | 29.28,41.59 30.42,40.44 31.49,40.44 31.64,40.6 31.95,40.6 R39.3 | R9.7 43.99,41.36 43.99,40.75 R9.6 44.14,40.6 44.29,40.6 44.44,40.44 44.75,40.44 v45.05,40.75 | v45.05,37.09 46.12,37.09 C7.1 | 29.28,41.59 35.91,48.22 36.52,48.22 38.04,49.74 38.35,49.74 PS1.2 | 12V.1 11.22,49.28 11.22,44.25 16.56,38.92 16.56,37.24 15.03,35.72 PUMPBOX-2.4 | X13.1 22.35,22 20.82,22 20.52,21.7 20.52,17.28 22.65,15.15 JP1.1
  Bottom 0.406: v45.05,37.09 v45.05,40.75 38.5,47.3 38.5,49.74 PS1.2 38.35,49.89 37.59,49.89 36.37,51.11 30.58,51.11 15.18,35.72 PUMPBOX-2.4 14.88,35.57 14.88,34.81 13.66,33.59 13.66,30.23 5.58,22.16 JP16.2 5.58,22 5.58,17.28 5.74,17.13 JP2.3 5.89,16.97 5.89,14.99 | 5.89,14.99 5.89,11.18 JP4.3 | 5.89,14.99 22.5,14.99 JP1.1
EN  (via drill 0.35)
  Top 0.356: v32.25,24.59 32.25,25.36 IC7.3 | v32.56,37.09 32.86,37.09 35,39.23 35,39.68 34.08,40.6 33.78,40.6 R39.6
  Bottom 0.356: v32.25,24.59 32.25,36.79 v32.56,37.09
GND
  pour Top: 0.1,0.06 55.1,0.06 55.1,33.06 55.1,53.06 30.1,53.06 0.1,53.06
ISO-1-5V  (via drill 0.35)
  Top 0.356: v36.98,38.31 37.13,38.16 37.13,37.09 C6.1 37.28,36.94 v37.28,35.87 | R10.6 40.33,20.33 40.33,19.72 R10.7 40.18,19.57 39.72,19.57 39.11,18.96 39.11,18.8 38.96,18.65 | 38.96,18.65 38.96,16.06 38.65,15.76 38.65,15.15 JP8.1 | 33.47,21.85 35.61,21.85 38.81,18.65 38.96,18.65 | 33.47,21.85 28.9,21.85 28.75,22 27.83,22 X13.8 | v33.47,22.16 33.47,21.85
  Bottom 0.356: v36.98,38.31 36.98,38.92 33.47,42.43 33.47,49.74 PS1.4 | v37.28,35.87 37.28,25.97 v33.47,22.16
ISO-GND-1  (via drill 0.35)
  Top 0.356: JP7.3 38.65,33.13 38.65,33.59 39.26,34.2 39.26,34.5 38.96,34.81 38.96,36.94 C6.2 38.96,37.09 38.96,37.85 v37.89,38.92 | v29.51,18.5 29.36,18.5 29.05,18.19 27.83,18.19 X13.5
  Bottom 0.356: v29.51,18.5 29.51,20.63 36.37,27.49 36.37,36.18 36.98,36.79 37.59,36.79 38.5,35.87 38.5,33.13 JP7.3 | v37.89,38.92 35.91,40.9 35.91,49.74 PS1.3
N$1
  Bottom 0.356: X11.1 51.91,25.2 45.51,25.2 43.23,22.92 35.45,22.92 28.9,16.37 26.46,16.37 25.24,15.15 JP1.2
N$3
  Bottom 0.356: X11.2 51.91,22.77 47.49,22.77 41.09,16.37 29.81,16.37 28.6,15.15 27.68,15.15 JP1.3
N$14
  Bottom 0.356: 50.54,15.15 43.68,15.15 JP8.3 | 50.54,15.15 51.91,16.52 X1.GND@4 | X1.GND@3 51.91,11.64 51.91,13.62 50.54,14.99 50.54,15.15
N$16
  Top 0.356: JP8.2 41.24,14.99 41.24,14.69 42.62,13.32 49.02,13.32 49.63,13.93 51.91,13.93 X1.P
N$39
  Top 0.356: IC7.1 32.1,26.73 31.95,26.73 31.64,27.03 31.49,27.03 31.19,26.73 13.05,26.73 8.48,22.16 8.17,22.16 JP16.1
N$41  (via drill 0.35)
  Top 0.356: v21.13,25.81 18.08,22.77 12.75,22.77 D26.A | v33.32,38.77 33.62,39.07 33.62,39.68 R39.5
  Bottom 0.356: v21.13,25.81 21.13,33.43 29.97,42.27 31.03,42.27 33.32,39.99 v33.32,38.77
N$47
  Top 0.356: 12V.2 13.05,49.44 13.81,49.44 14.57,50.2 14.57,50.66 15.03,51.11 15.79,51.11 LED4.A
N$54
  Top 0.356: R24.2 15.03,11.95 14.12,11.95 12.59,10.42 12.59,8.9 12.14,8.44 12.14,8.14 LED11.A
N$55
  Top 0.356: R25.2 25.09,11.79 24.02,11.79 21.28,9.05 21.28,8.14 LED12.A
N$56
  Top 0.356: R26.2 34.08,11.79 33.01,11.79 30.27,9.05 30.27,8.14 LED13.A
N$57
  Top 0.356: R27.2 43.07,11.79 42.01,11.79 39.26,9.05 39.26,8.14 LED14.A
SCL  (via drill 0.35)
  Top 0.356: JP4.1 10.92,11.18 10.92,12.25 11.83,13.16 11.83,14.99 10.92,15.91 10.92,16.97 JP2.1 | IC7.6 33.93,26.73 33.93,27.34 29.2,32.06 29.05,32.06 28.14,32.98 27.68,32.98 JP3.1 27.53,33.13 25.7,31.3 22.5,31.3 22.35,31.45 16.25,31.45 15.49,30.69 15.03,30.69 PUMPBOX-2.8 | v30.73,41.36 31.03,41.66 31.19,41.66 31.34,41.51 31.49,41.51 31.64,41.36 31.95,41.36 R39.2 | v41.09,40.75 41.4,40.44 41.7,40.44 41.85,40.6 42.16,40.6 R9.3 | v49.93,31.45 51.3,31.45 J5.4 | v50.85,39.53 51.3,39.99 51.3,40.44 J4.4 | v24.33,19.87 23.87,19.41 X13.3
  Bottom 0.356: 30.73,38.01 30.73,36.18 27.68,33.13 JP3.1 27.53,32.98 27.53,23.38 24.33,20.18 v24.33,19.87 24.18,19.87 20.06,15.76 18.23,15.76 17.01,16.97 10.92,16.97 JP2.1 | 30.73,38.01 v30.73,41.36 | 40.56,40.22 37.74,37.4 33.47,37.4 32.86,38.01 30.73,38.01 | 40.56,40.22 v41.09,40.75 | v49.93,31.45 49.32,31.45 46.05,34.73 | 40.56,40.22 46.05,34.73 | 46.05,34.73 v50.85,39.53
SCL2  (via drill 0.35)
  Top 0.356: 43.23,22 43.23,23.53 v42.92,23.83 | 43.23,22 43.23,20.63 43.07,20.48 42.92,20.48 42.77,20.63 42.46,20.63 42.31,20.48 42.01,20.48 R10.3 | v31.34,17.58 31.34,17.89 29.66,19.57 29.2,19.57 29.05,19.41 27.83,19.41 X13.6 | v42.92,22 43.23,22
  Bottom 0.356: v42.92,23.83 42.92,32.37 43.53,32.98 JP7.1 | v31.34,17.58 31.34,17.89 35.45,22 v42.92,22
SDA  (via drill 0.35)
  Top 0.356: JP4.2 8.48,11.18 8.48,12.4 9.24,13.16 9.24,14.99 8.48,15.76 8.48,16.97 JP2.2 | 40.56,42.65 41.55,41.66 41.85,41.66 42.16,41.36 R9.2 | 40.56,42.65 39.87,43.34 32.25,43.34 31.95,43.04 31.95,42.43 R39.1 | 33.93,24.75 33.93,25.36 IC7.4 | 33.93,24.75 32.25,23.07 26.31,23.07 24.56,21.32 | 24.56,21.32 24.02,20.78 23.72,20.78 23.57,20.63 22.5,20.63 X13.2 | 49.93,32.52 45.51,32.52 37.43,24.44 34.08,24.44 33.93,24.59 33.93,24.75 | 49.93,32.52 51.3,32.52 J5.3 | v52.83,41.51 51.46,41.51 J4.3 | v49.93,32.67 49.93,32.52 | v42.46,44.56 40.56,42.65 | v24.33,21.39 24.48,21.39 24.56,21.32
  Bottom 0.356: 15.87,29.85 14.88,28.86 13.2,28.86 9.55,25.2 9.55,18.19 8.48,17.13 JP2.2 | 15.87,29.85 16.25,30.23 16.25,31 15.03,32.21 15.03,33.13 PUMPBOX-2.6 | v49.93,32.67 52.83,35.57 v52.83,41.51 52.67,41.51 49.63,44.56 v42.46,44.56 | v24.33,21.39 15.87,29.85
SDA2  (via drill 0.35)
  Top 0.356: 43,19.64 43.23,19.87 43.38,19.87 43.84,20.33 43.84,24.14 v42.01,25.97 | 43,19.64 42.77,19.41 42.62,19.41 42.46,19.57 42.01,19.57 R10.2 | v32.41,17.74 29.51,20.63 27.83,20.63 X13.7 | v43.07,19.57 43,19.64
  Bottom 0.356: v42.01,25.97 42.01,32.21 41.24,32.98 JP7.2 | v32.41,17.74 41.24,17.74 v43.07,19.57

### Text on the board
tPlace: PWR | Drone 1.0 | ©HiveBoards 2023 | ⏚ | QWIIC Connectors | P1/P2/P3/P4 / SCL/SDA/5v/GND | ⏚ | Non Isolated / EZO / Connector | Isolated / EZO / Connector | ⏚ | I2C Boost Enable | NISO-1 | on | GND/5v/SDA/SCL | ISO-1 | Output 1 | Output 2 | Output 3 | Output 4